# EAGLE design uart_level_shifter (EAGLE 7.7.0)
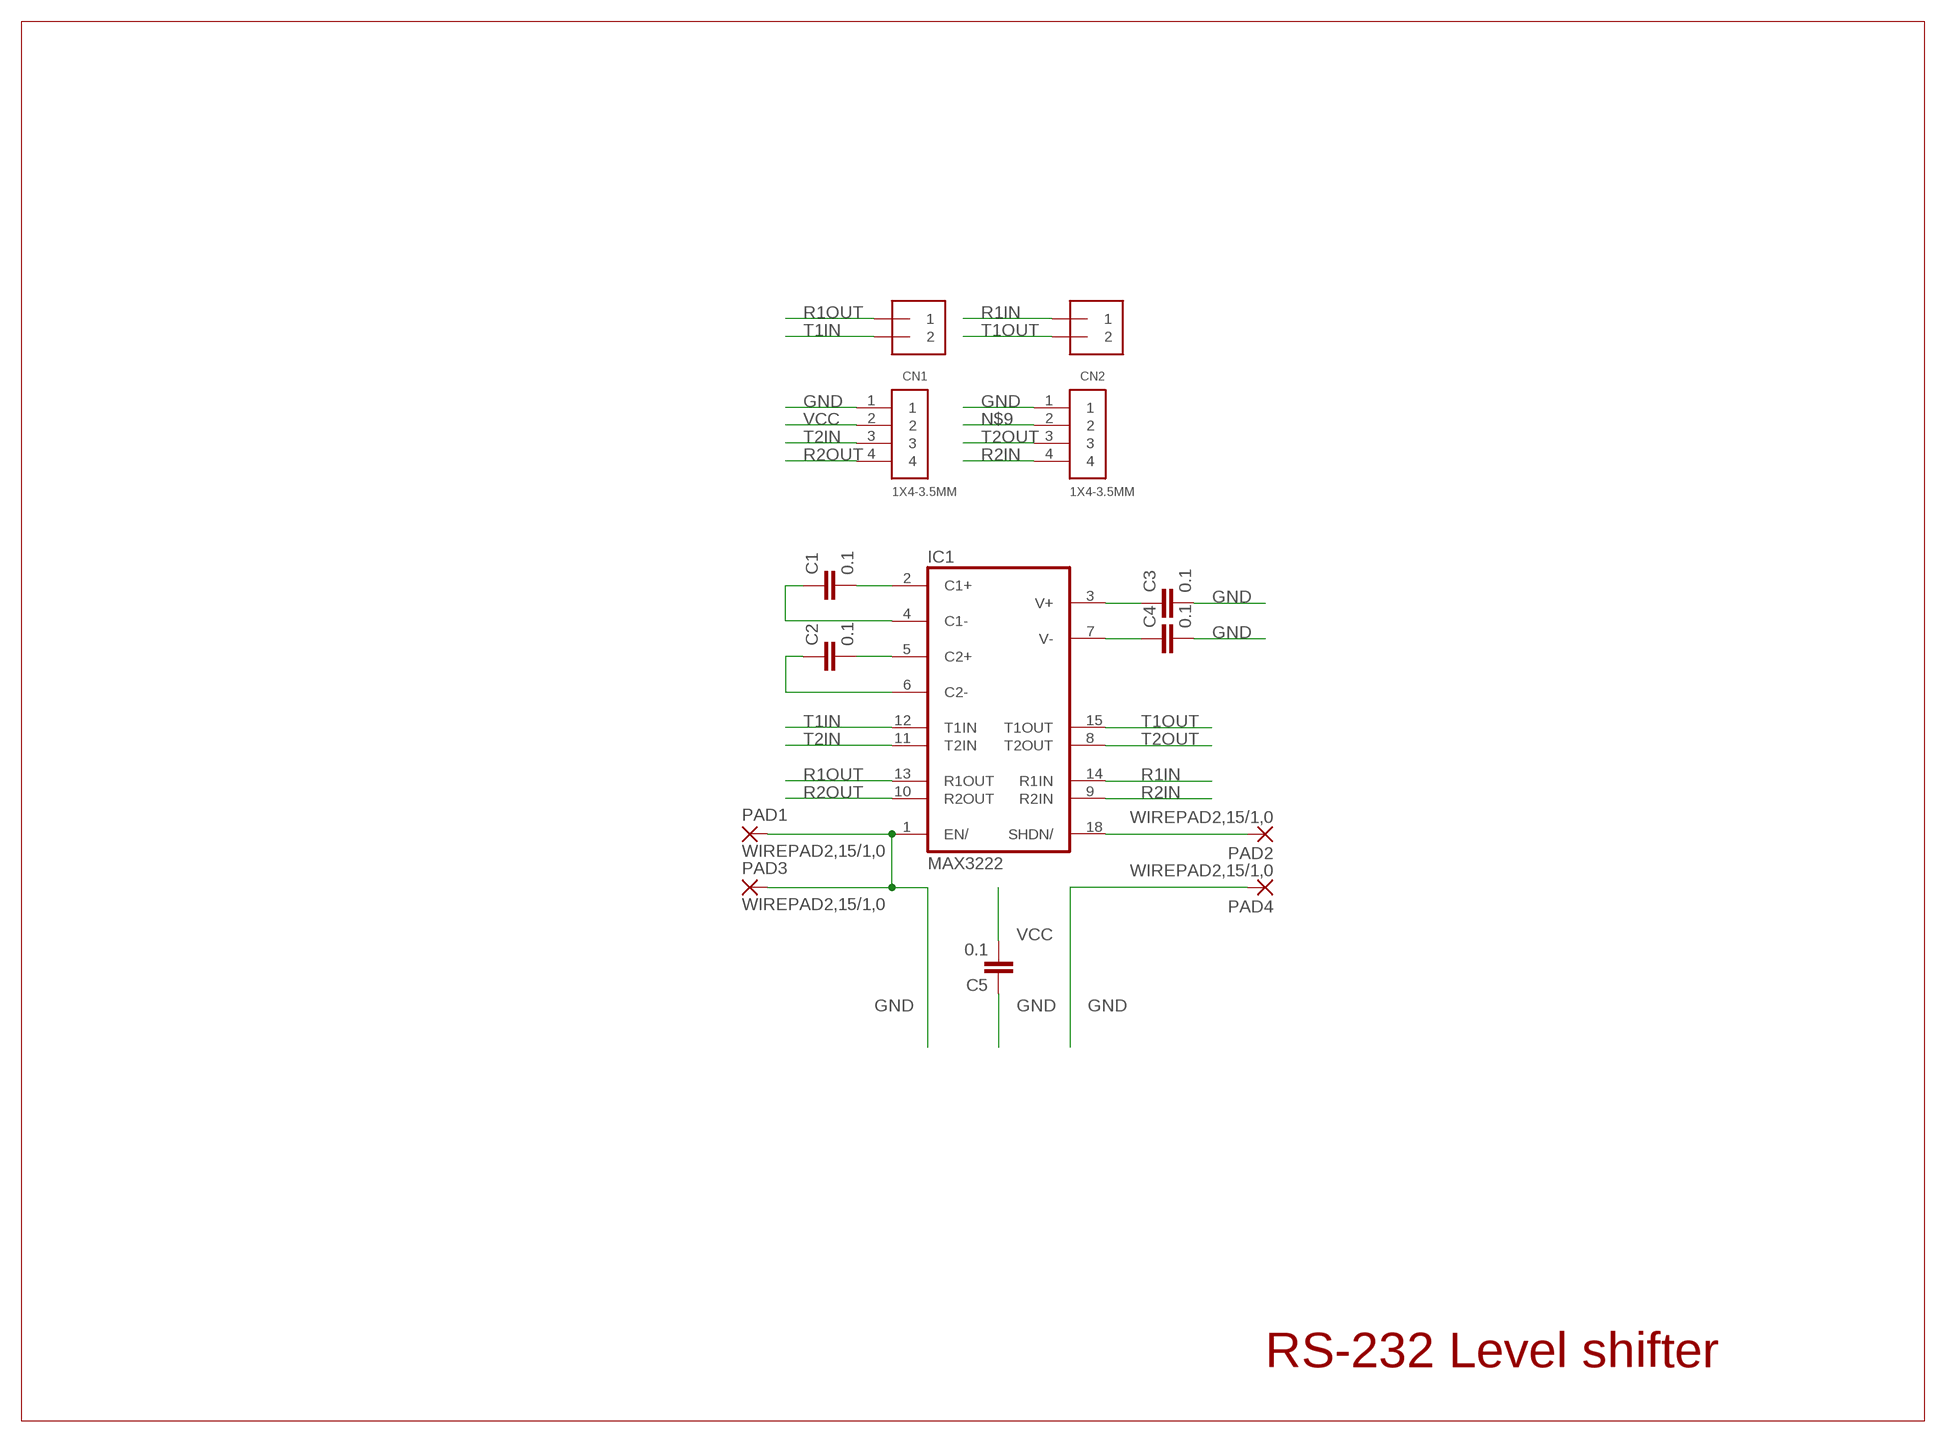
[diagram p0: schematic, sheet 1]

## Parts
C1  0.1  C-EUC0805  [C0805]
C2  0.1  C-EUC0805  [C0805]
C3  0.1  C-EUC0805  [C0805]
C4  0.1  C-EUC0805  [C0805]
C5  0.1  C-EUC0805  [C0805]
CN1  1X4-3.5MM  [1X04-3.5MM]
CN2  1X4-3.5MM  [1X04-3.5MM]
IC1  MAX3222  [DIL18]
J1  1X2-3.5MM  [1X2-3.5MM]
J2  1X2-3.5MM  [1X2-3.5MM]
PAD1  WIREPAD2,15/1,0  [2,15/1,0]
PAD2  WIREPAD2,15/1,0  [2,15/1,0]
PAD3  WIREPAD2,15/1,0  [2,15/1,0]
PAD4  WIREPAD2,15/1,0  [2,15/1,0]

## Nets
GND: C3.2 C4.2 C5.1 CN1.1 CN2.1 IC1.1(EN/) PAD1.1(P) PAD3.1(P) PAD4.1(P)
N$1: C2.2 IC1.5(C2+)
N$2: C2.1 IC1.6(C2-)
N$3: C1.1 IC1.4(C1-)
N$4: C1.2 IC1.2(C1+)
N$5: C3.1 IC1.3(V+)
N$7: IC1.18(SHDN/) PAD2.1(P)
N$8: C4.1 IC1.7(V-)
N$9: CN2.2
R1IN: IC1.14(R1IN) J2.1
R1OUT: IC1.13(R1OUT) J1.1
R2IN: CN2.4 IC1.9(R2IN)
R2OUT: CN1.4 IC1.10(R2OUT)
T1IN: IC1.12(T1IN) J1.2
T1OUT: IC1.15(T1OUT) J2.2
T2IN: CN1.3 IC1.11(T2IN)
T2OUT: CN2.3 IC1.8(T2OUT)
VCC: C5.2 CN1.2

## Notes on the sheet
- RS-232 Level shifter

## Power pins joined to a net without a drawn wire
GND: IC1.16(GND)
VCC: IC1.17(VCC)

## Library data of the parts
C1-C5 = rcl:C-EU: CAPACITOR, European symbol
CN1 CN2 = adafruit:1X4: 4-pin connector
IC1 = maxim:MAX3222: RS232 TRANSCEIVER; MPN: MAX3222EPN+; OC_FARNELL: 1188044; OC_NEWARK: 99K3237
J1 J2 = adafruit:1X2: 3.5mm Terminal block http://www.ladyada.net/library/pcb/eaglelibrary.html
PAD1-PAD4 = wirepad:WIREPAD: Wire PAD connect wire on PCB

## Board
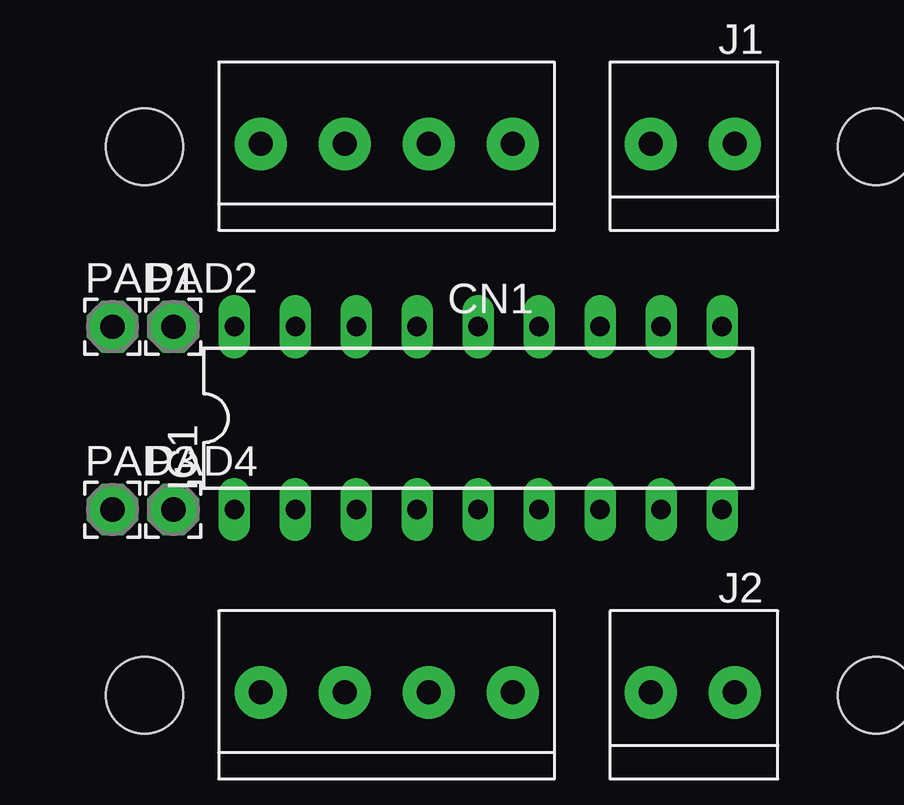
[diagram p1: board, top side]
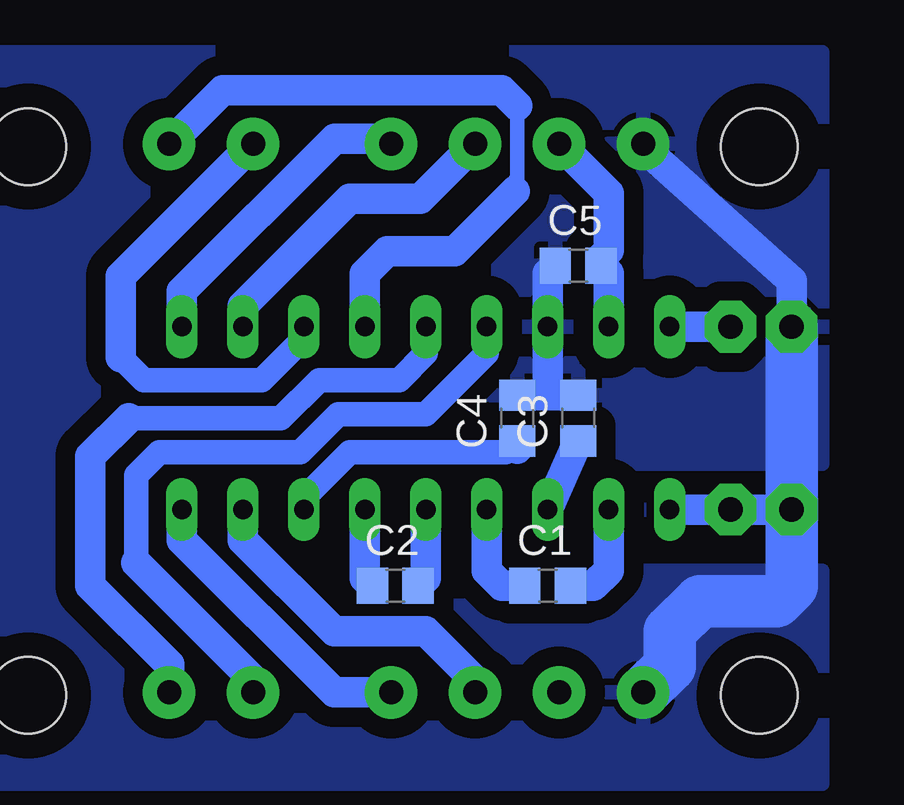
[diagram p2: board, bottom side, seen from below]

No outline drawn. Coordinates in mm, seen from the top.
Copper layers (1*16): Top 0.035mm / dielectric 1.5mm / Bottom 0.035mm
Design rules "default": minimum track width 10mil, minimum drill 24mil, track to track 8mil, track to pad 8mil, pad to pad 8mil, via to via 8mil, smd to smd 8mil, copper to edge 40mil, drill to drill 8mil, minimum pad ring 10mil, minimum via ring 8mil, stop-mask expansion 4mil, vias tented up to drill 0mil, thermal gap 10mil
Holes 3.2 mm at 2.61,3.69 33.09,3.69 2.61,26.55 33.09,26.55

### Footprints (pad centres in the part's own frame; a part is rotated, then mirrored left to right if it is on the bottom)
C0805 = smd 1.3 x 1.5: 1 -0.95,0; 2 0.95,0
1X04-3.5MM = drill 1 pad 2.184: 1 -5.25,0; 2 -1.75,0; 3 1.75,0; 4 5.25,0
DIL18 = drill 0.813 long: 1 -10.16,-3.81; 2 -7.62,-3.81; 3 -5.08,-3.81; 4 -2.54,-3.81; 5 0,-3.81; 6 2.54,-3.81; 7 5.08,-3.81; 8 7.62,-3.81; 9 10.16,-3.81; 10 10.16,3.81; 11 7.62,3.81; 12 5.08,3.81; 13 2.54,3.81; 14 0,3.81; 15 -2.54,3.81; 16 -5.08,3.81; 17 -7.62,3.81; 18 -10.16,3.81
1X2-3.5MM = drill 1 pad 2.184: 1 1.8,0; 2 -1.7,0
2,15/1,0 = drill 1.016 pad 2.159 octagon: 1 0,0

### Placement (x,y rotation side)
C1  11.43,8.26 0 bottom
C2  17.78,8.26 0 bottom
C3  10.16,15.24 90 bottom
C4  12.7,15.24 90 bottom
C5  10.16,21.59 0 bottom
CN1  12.7,26.67 0 top
CN2  12.7,3.81 0 top
IC1  16.51,15.24 0 top
J1  25.4,26.67 0 top
J2  25.4,3.81 0 top
PAD1  1.27,19.05 0 top
PAD2  3.81,19.05 0 top
PAD3  1.27,11.43 0 top
PAD4  3.81,11.43 0 top

### Tracks (layer width: path | path; a pad name or v marks a point on that pad's centre or on a via)
GND
  Bottom 1.27: C3.2 11.43,16.19 | 11.43,16.19 C4.2 | C5.1 11.43,21.27 IC1.16 11.43,16.19 | CN1.1 7.62,26.67 1.27,20.95 PAD1.1 | PAD3.1 PAD4.1 IC1.1
  Bottom 2.184: PAD1.1 PAD3.1 1.27,8.26 1.91,7.62 5.08,7.62 6.35,6.35 6.35,4.91 CN2.1
  pour Bottom (isolate 0.813): 0,0 0,8.89 7.62,8.89 7.62,13.34 0,13.34 0,30.48 35.56,30.48 35.56,0
N$1
  Bottom 1.27: IC1.5 16.51,8.57 C2.2
N$2
  Bottom 1.27: IC1.6 19.05,8.57 C2.1
N$3
  Bottom 1.27: C1.1 13.34,8.26 13.97,8.89 IC1.4
N$4
  Bottom 1.27: C1.2 9.53,8.26 8.89,8.89 IC1.2
N$5
  Bottom 1.27: IC1.3 C3.1
N$7
  Bottom 1.27: IC1.18 PAD2.1
N$8
  Bottom 1.016: IC1.7 21.59,11.91 19.68,13.81 13.18,13.81 C4.1
  Bottom 1.27: C4.1 12.7,13.97
R1IN
  Bottom 1.016: 28.89,15.24 22.54,15.24 20.95,16.83 17.62,16.83 16.51,17.94 IC1.14
  Bottom 1.27: J2.1 27.2,4.97 30.48,8.26 30.48,13.65 28.89,15.24
R1OUT
  Bottom 0.61: 12.81,24.69 12.81,25.13 12.7,25.24 12.7,28.26
  Bottom 1.27: IC1.13 19.05,21.26 18.12,22.19 15.31,22.19 12.81,24.69 | 12.7,28.26 13.34,28.89 24.98,28.89 J1.1
R2IN
  Bottom 1.27: CN2.4 20.32,3.81 26.67,10.16 IC1.9
R2OUT
  Bottom 1.27: IC1.10 26.67,20.52 20.31,26.88 18.16,26.88 CN1.4
T1IN
  Bottom 1.016: 21.59,18.41 21.75,18.41 23.34,16.83 28.26,16.83 29.21,17.78
  Bottom 1.27: IC1.12 21.59,18.41 | 29.21,17.78 29.21,21.16 J1.2
T1OUT
  Bottom 1.016: 28.57,9.21 28.57,12.86 27.62,13.81 21.75,13.81 20.16,15.4 16.51,15.4 13.97,17.94 IC1.15
  Bottom 1.27: J2.2 23.7,4.33 28.57,9.21
T2IN
  Bottom 1.27: IC1.11 24.13,19.93 19.69,24.38 16.75,24.38 CN1.3
T2OUT
  Bottom 1.27: CN2.3 14.45,4.29 16.51,6.35 20.32,6.35 24.13,10.16 IC1.8
VCC
  Bottom 1.27: IC1.17 8.89,21.27 C5.2 9.21,21.91 8.89,22.23 8.89,24.61 CN1.2